# EAGLE design io_board (EAGLE 7.2.0)
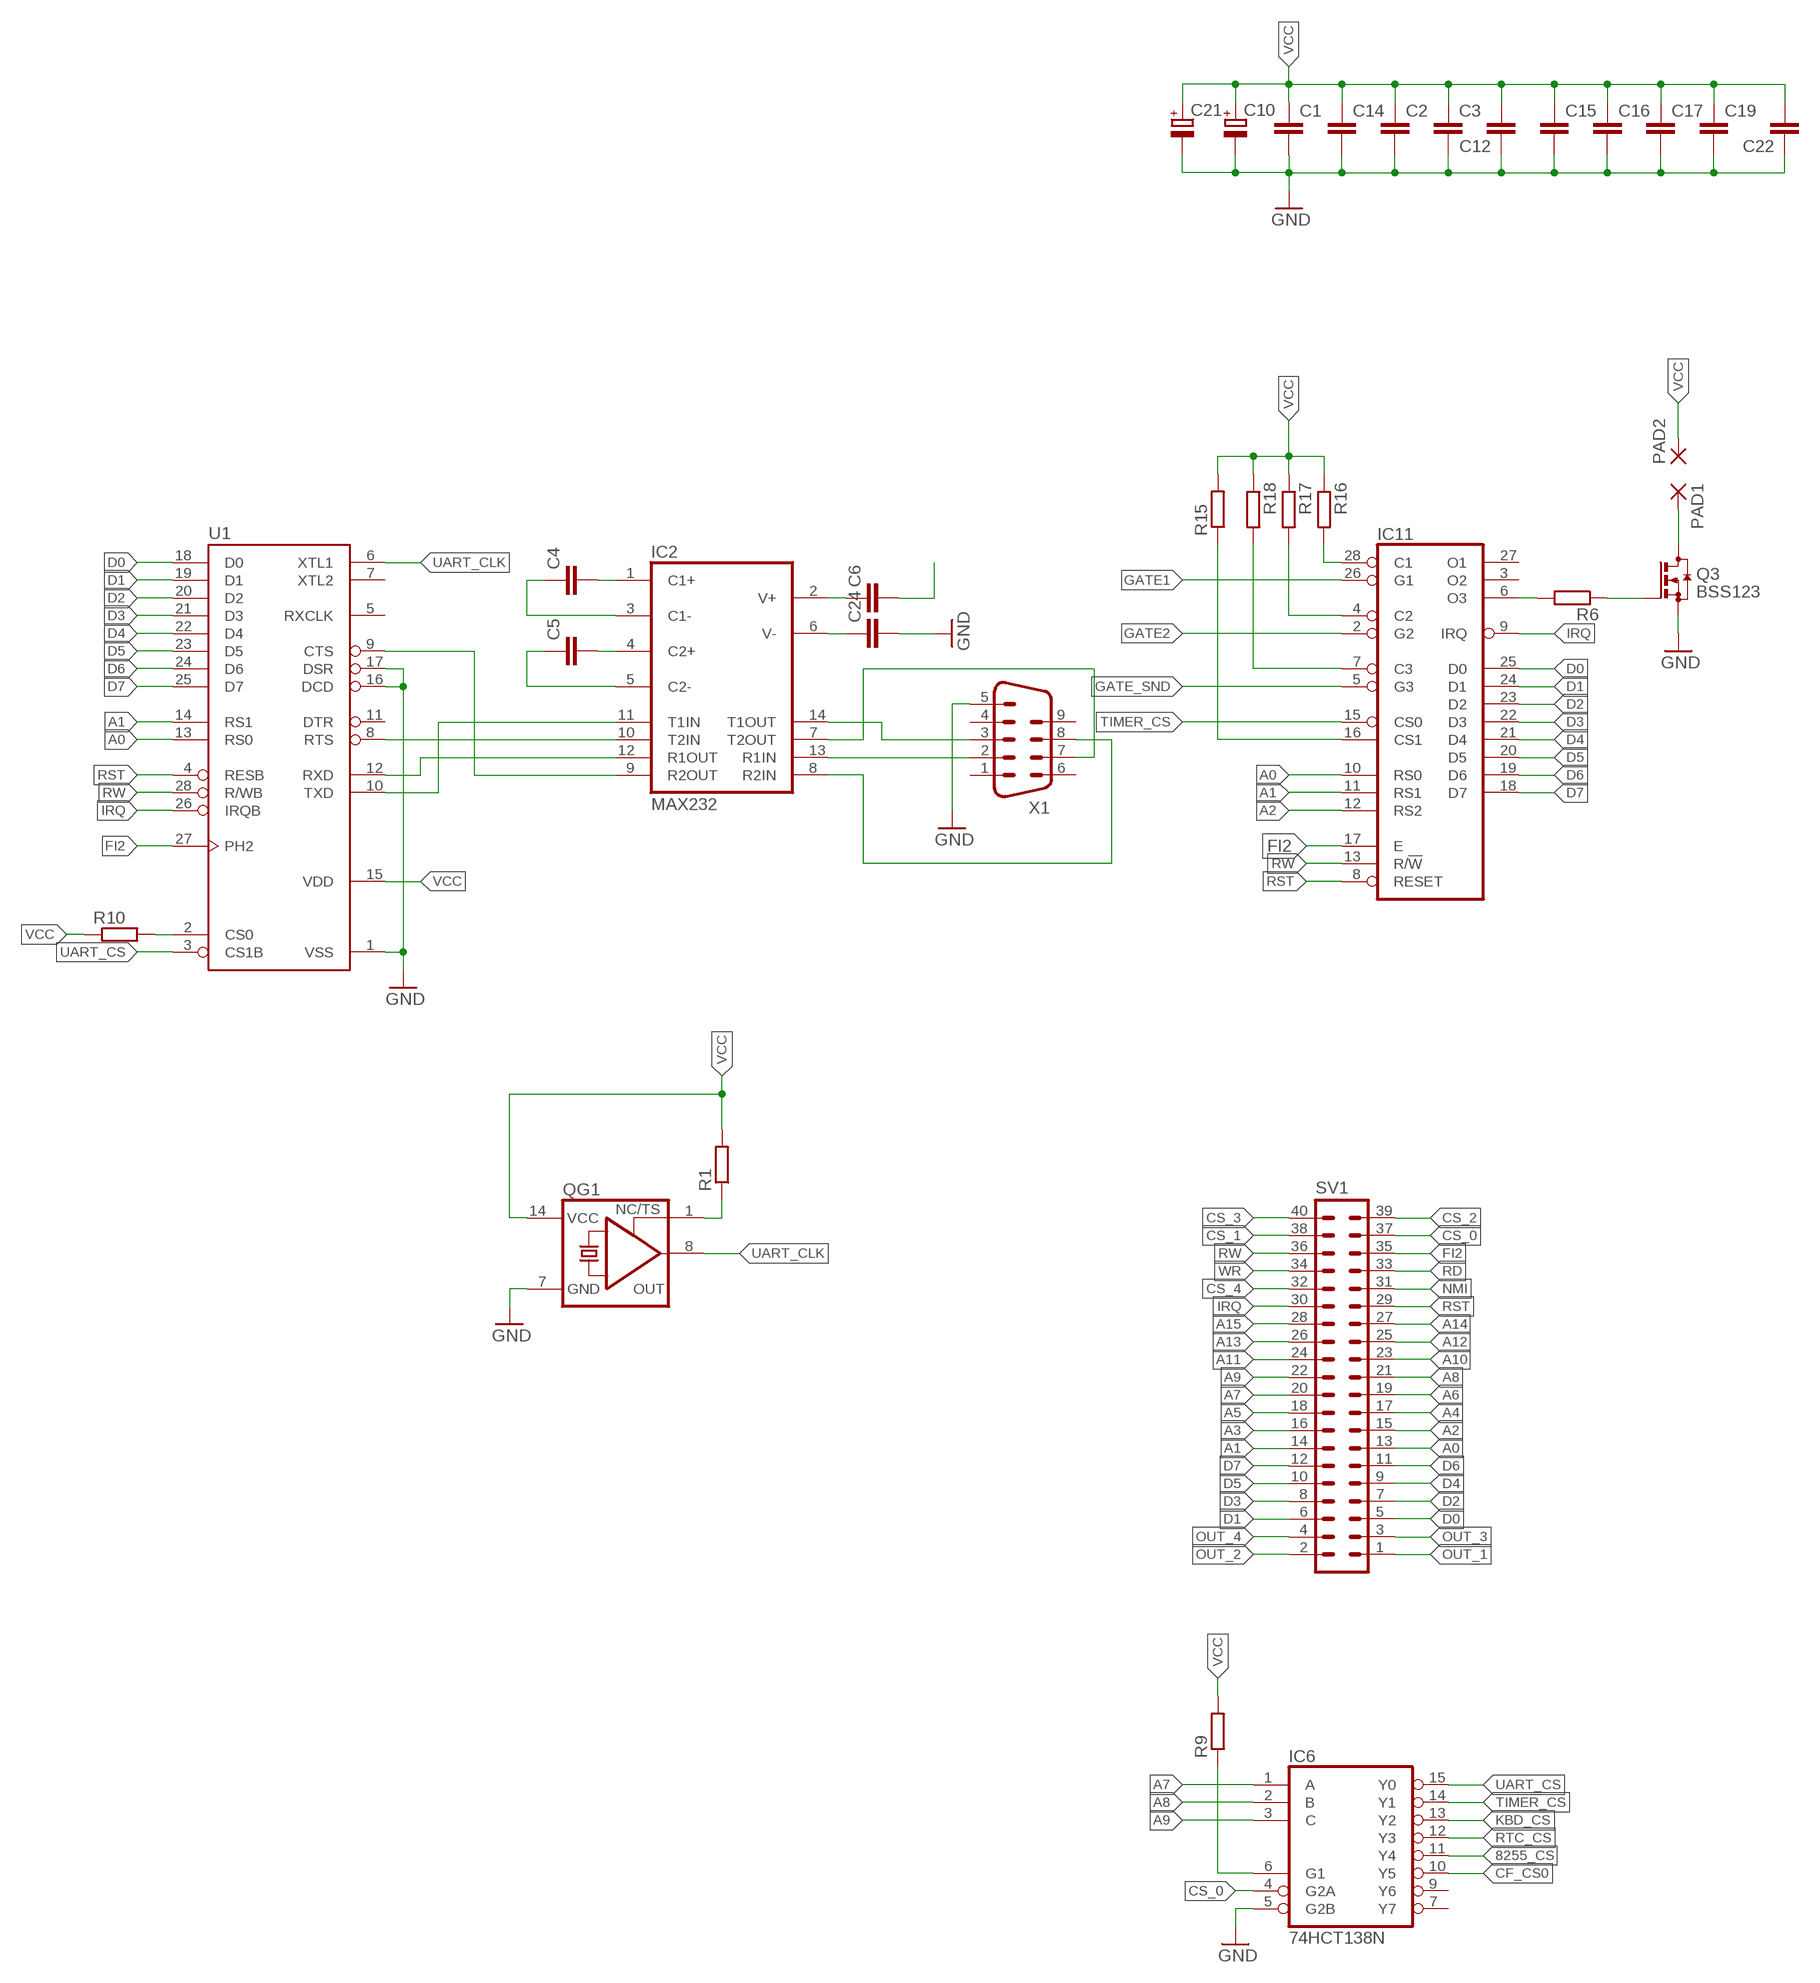
[diagram p0: schematic, sheet 1, part 1 of 2]
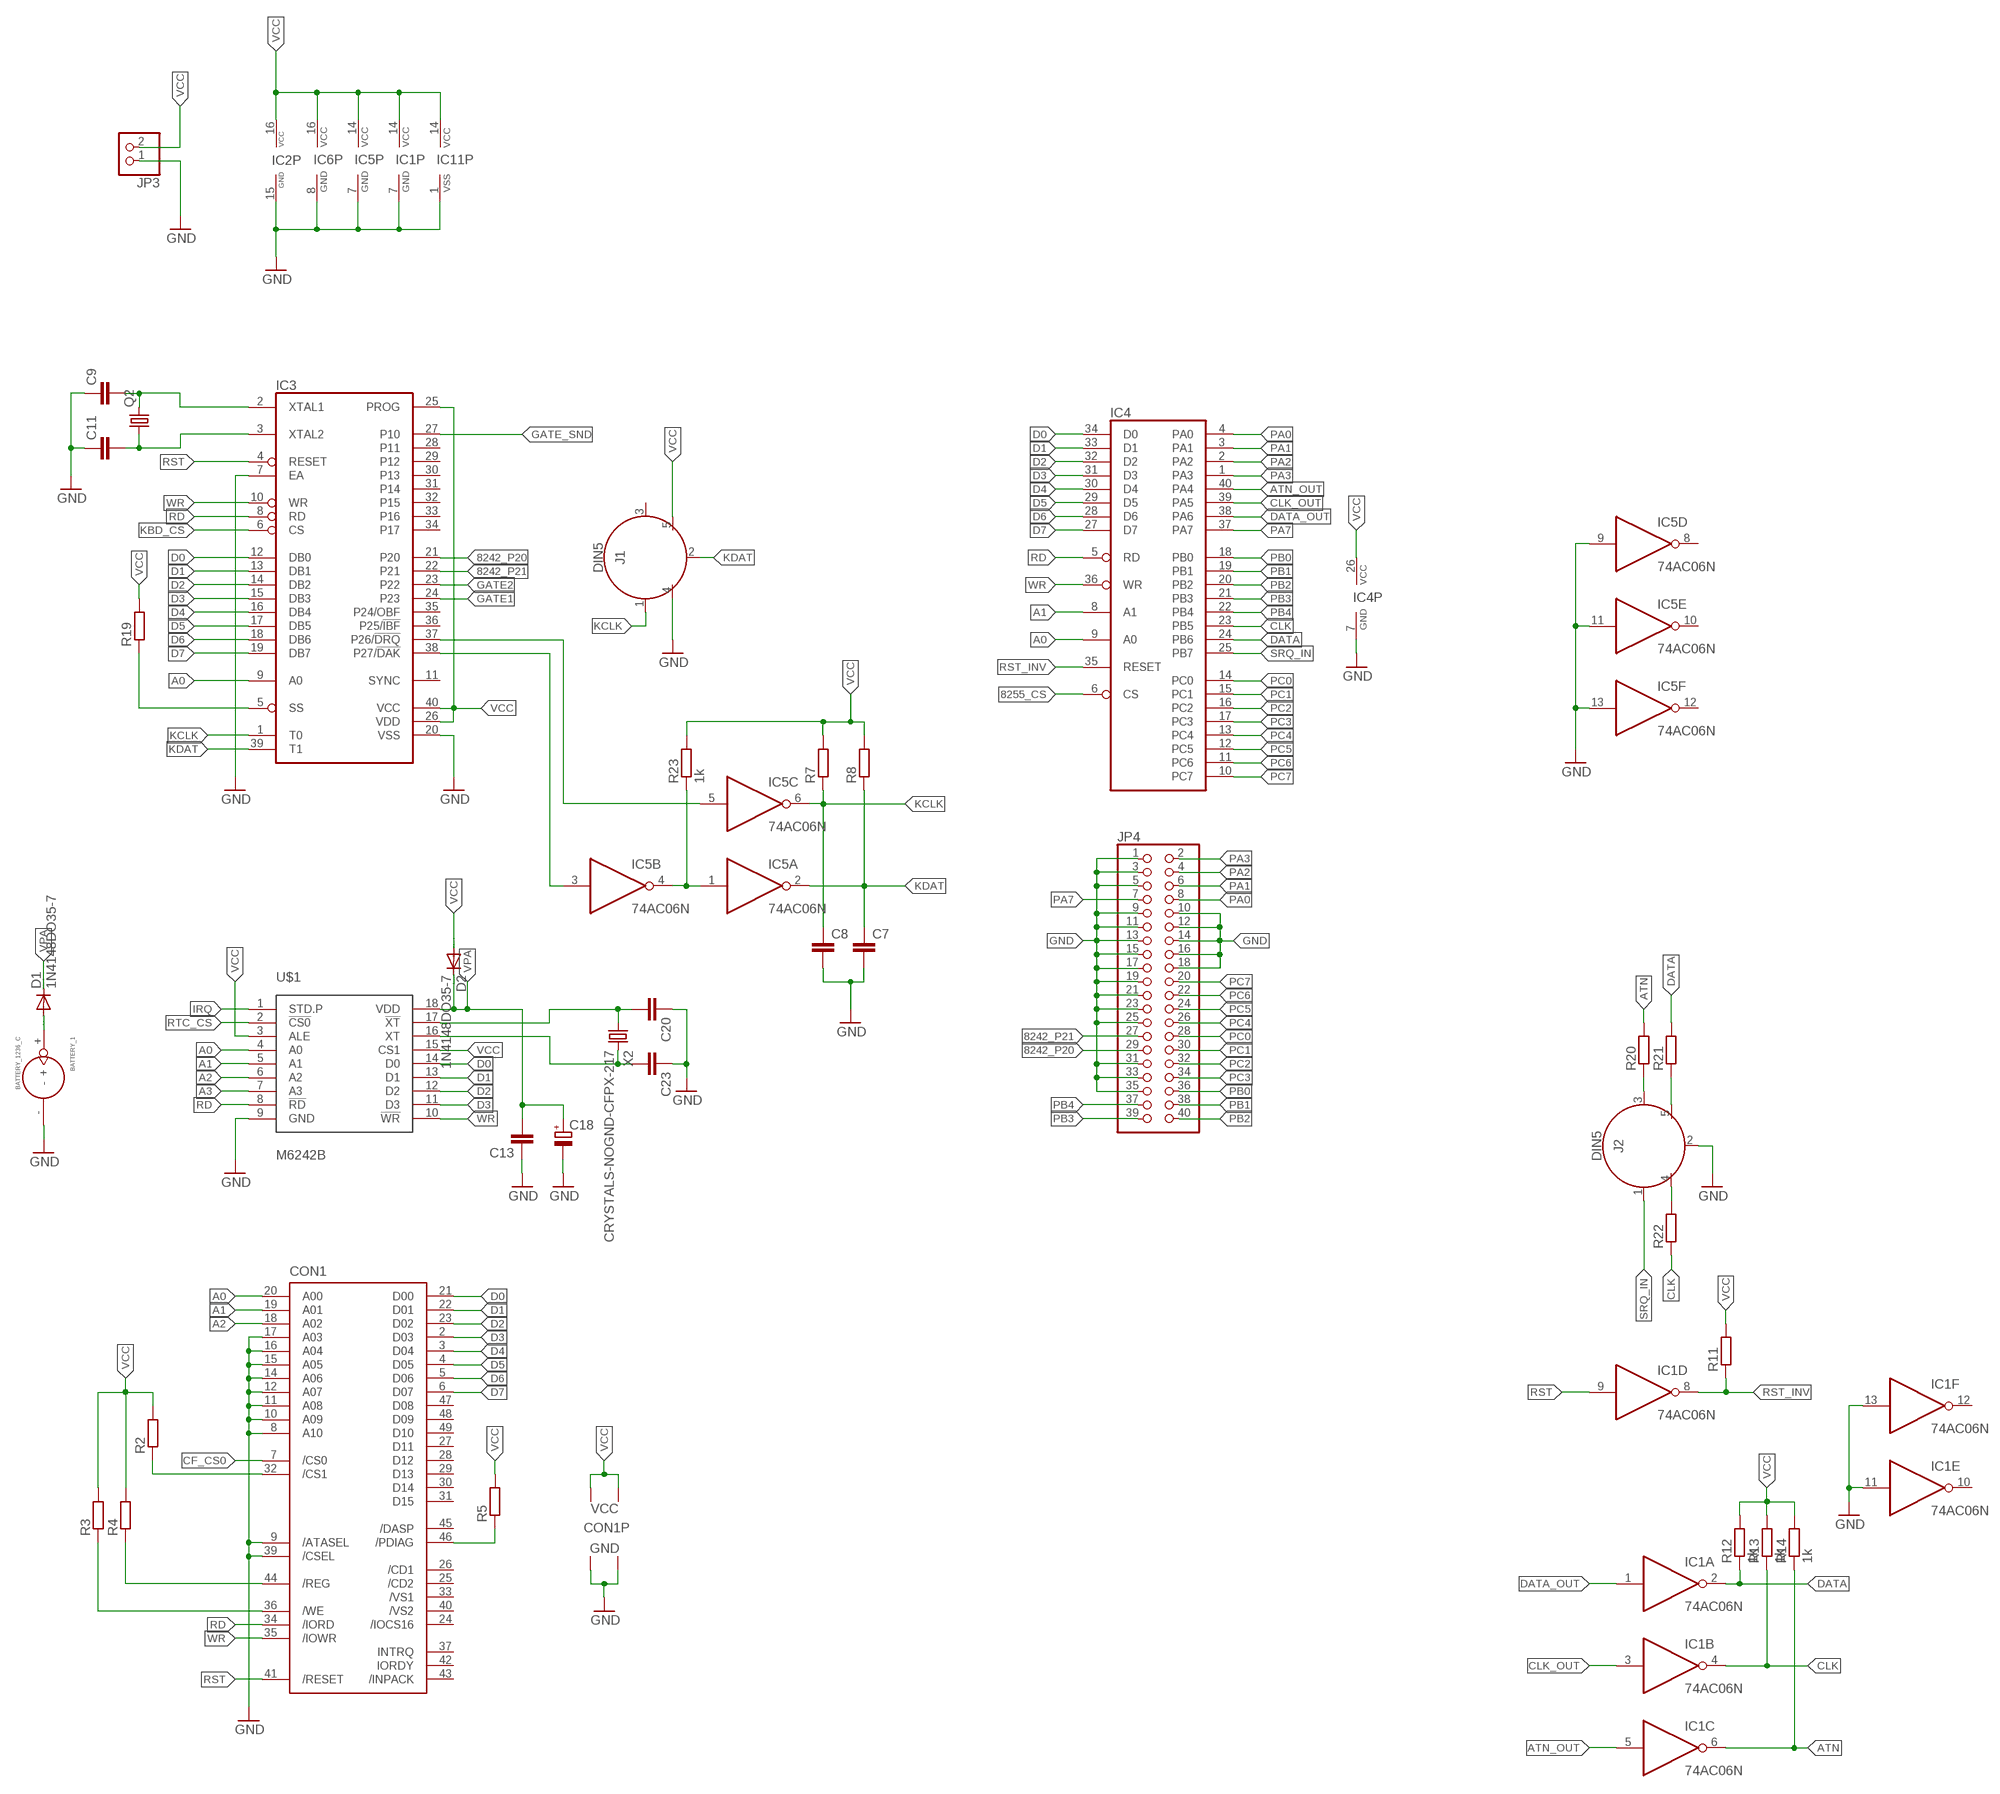
[diagram p1: schematic, sheet 1, part 2 of 2]

## Parts
BATTERY_1  BATTERY_1236_C  [BATTERY_1236_C]
C1  C-EUC1206  [C1206]
C2  C-EUC1206  [C1206]
C3  C-EUC1206  [C1206]
C4  C-EUC0603  [C0603]
C5  C-EUC0603  [C0603]
C6  C-EUC0603  [C0603]
C7  C-EUC0603  [C0603]
C8  C-EUC0603  [C0603]
C9  C-EUC0603  [C0603]
C10  CPOL-EUE5-10.5  [E5-10,5]
C11  C-EUC0603  [C0603]
C12  C-EUC0603  [C0603]
C13  C-EUC0603  [C0603]
C14  C-EUC1206  [C1206]
C15  C-EUC1206  [C1206]
C16  C-EUC1206  [C1206]
C17  C-EUC1206  [C1206]
C18  CPOL-EUSMCB  [SMC_B]
C19  C-EUC0603  [C0603]
C20  C-EUC0603  [C0603]
C21  CPOL-EUSMCB  [SMC_B]
C22  C-EUC0603  [C0603]
C23  C-EUC0603  [C0603]
C24  C-EUC0603  [C0603]
CON1  CF-CARD-IDE_MODE  [MI20-50PD-SF]
D1  1N4148DO35-7  [DO35-7]
D2  1N4148DO35-7  [DO35-7]
IC1  74AC06N  [DIL14]
IC2  MAX232  [DIL16]
IC3  UPI-8042AH  [DIL40]
IC4  8255A  [DIL40]
IC5  74AC06N  [DIL14]
IC6  74HCT138N  [DIL16]
IC11  6840  [DIL28]
J1  DIN5  [DIN5-RA-PTH]
J2  DIN5  [DIN5-RA-PTH]
JP3  PINHD-1X2/90  [1X02/90]
JP4  PINHD-2X20  [2X20]
PAD1  2,15/1,0  [2,15/1,0]
PAD2  2,15/1,0  [2,15/1,0]
Q2  CRYSTALHC49S  [HC49/S]
Q3  BSS123  [SOT23]
QG1  XO-14  [DIL14S]
R1  R-EU_R1206  [R1206]
R2  R-EU_R0603  [R0603]
R3  R-EU_R0603  [R0603]
R4  R-EU_R0603  [R0603]
R5  R-EU_R0603  [R0603]
R6  R-EU_R0603  [R0603]
R7  R-EU_R0603  [R0603]
R8  R-EU_R0603  [R0603]
R9  R-EU_R1206  [R1206]
R10  R-EU_R0603  [R0603]
R11  R-EU_R0603  [R0603]
R12  1k  R-EU_0204/7  [0204/7]
R13  1k  R-EU_0204/5  [0204/5]
R14  1k  R-EU_0204/7  [0204/7]
R15  R-EU_R0603  [R0603]
R16  R-EU_0204/5  [0204/5]
R17  R-EU_R0603  [R0603]
R18  R-EU_R0603  [R0603]
R19  R-EU_0204/5  [0204/5]
R20  R-EU_R0805  [R0805]
R21  R-EU_R0805  [R0805]
R22  R-EU_R0805  [R0805]
R23  1k  R-EU_0204/7  [0204/7]
SV1  ML40L  [ML40L]
U1  G65SC51P  [DIP-28]
U$1  M6242B  [DIL18]
X1  M09HP  [M09HP]
X2  CRYSTALS-NOGND-CFPX-217  [3.2X1.5-2-PAD]

## Nets
8242_P20: IC3.21(P20) JP4.29
8242_P21: IC3.22(P21) JP4.27
8255_CS: IC4.6(CS) IC6.11(Y4)
A0: CON1.20(A00) IC3.9(A0) IC4.9(A0) IC11.10(RS0) SV1.13 U1.13(RS0) U$1.4(A0)
A1: CON1.19(A01) IC4.8(A1) IC11.11(RS1) SV1.14 U1.14(RS1) U$1.5(A1)
A2: CON1.18(A02) IC11.12(RS2) SV1.15 U$1.6(A2)
A3: SV1.16 U$1.7(A3)
A4: SV1.17
A5: SV1.18
A6: SV1.19
A7: IC6.1(A) SV1.20
A8: IC6.2(B) SV1.21
A9: IC6.3(C) SV1.22
A10: SV1.23
A11: SV1.24
A12: SV1.25
A13: SV1.26
A14: SV1.27
A15: SV1.28
ATN: IC1.6(C:O) R14.1 R20.2
ATN_OUT: IC1.5(C:I) IC4.40(PA4)
CF_CS0: CON1.7(/CS0) IC6.10(Y5)
CLK: IC1.4(B:O) IC4.23(PB5) R13.1 R22.1
CLK_OUT: IC1.3(B:I) IC4.39(PA5)
CS_0: IC6.4(G2A) SV1.37
CS_1: SV1.38
CS_2: SV1.39
CS_3: SV1.40
CS_4: SV1.32
CTS_RS232: IC2.8(R2IN) X1.8
CTS_TTL: IC2.9(R2OUT) U1.9(CTS)
D0: CON1.21(D00) IC3.12(DB0) IC4.34(D0) IC11.25(D0) SV1.5 U1.18(D0) U$1.14(D0)
D1: CON1.22(D01) IC3.13(DB1) IC4.33(D1) IC11.24(D1) SV1.6 U1.19(D1) U$1.13(D1)
D2: CON1.23(D02) IC3.14(DB2) IC4.32(D2) IC11.23(D2) SV1.7 U1.20(D2) U$1.12(D2)
D3: CON1.2(D03) IC3.15(DB3) IC4.31(D3) IC11.22(D3) SV1.8 U1.21(D3) U$1.11(D3)
D4: CON1.3(D04) IC3.16(DB4) IC4.30(D4) IC11.21(D4) SV1.9 U1.22(D4)
D5: CON1.4(D05) IC3.17(DB5) IC4.29(D5) IC11.20(D5) SV1.10 U1.23(D5)
D6: CON1.5(D06) IC3.18(DB6) IC4.28(D6) IC11.19(D6) SV1.11 U1.24(D6)
D7: CON1.6(D07) IC3.19(DB7) IC4.27(D7) IC11.18(D7) SV1.12 U1.25(D7)
DATA: IC1.2(A:O) IC4.24(PB6) R12.1 R21.2
DATA_OUT: IC1.1(A:I) IC4.38(PA6)
FI2: IC11.17(E) SV1.35 U1.27(PH2)
GATE1: IC3.24(P23) IC11.26(G1)
GATE2: IC3.23(P22) IC11.2(G2)
GATE_SND: IC3.27(P10) IC11.5(G3)
GND: BATTERY_1.- C1.2 C2.2 C3.2 C7.2 C8.2 C9.1 C10.- C11.1 C12.1 C13.1 C14.2 C15.2 C16.2 C17.2 C18.- C19.2 C20.1 C21.- C22.1 C23.1 C24.2 CON1.1(GND1) CON1.8(A10) CON1.9(/ATASEL) CON1.10(A09) CON1.11(A08) CON1.12(A07) CON1.14(A06) CON1.15(A05) CON1.16(A04) CON1.17(A03) CON1.39(/CSEL) CON1.50(GND2) IC1.7(P:GND) IC1.11(E:I) IC1.13(F:I) IC2.15(GND) IC3.7(EA) IC3.20(VSS) IC4.7(GND) IC5.7(P:GND) IC5.9(D:I) IC5.11(E:I) IC5.13(F:I) IC6.5(G2B) IC6.8(GND) IC11.1(VSS) J1.4 J2.2 JP3.1 JP4.1 JP4.3 JP4.5 JP4.9 JP4.10 JP4.11 JP4.12 JP4.13 JP4.14 JP4.15 JP4.16 JP4.17 JP4.18 JP4.19 JP4.21 JP4.23 JP4.25 JP4.31 JP4.33 JP4.35 Q3.2(S) QG1.7(GND) U1.1(VSS) U1.16(DCD) U1.17(DSR) U$1.9(GND) X1.5
IRQ: IC11.9(IRQ) SV1.30 U1.26(IRQB) U$1.1(STD.P)
KBD_CS: IC3.6(CS) IC6.13(Y2)
KCLK: C8.1 IC3.1(T0) IC5.6(C:O) J1.1 R7.1
KDAT: C7.1 IC3.39(T1) IC5.2(A:O) J1.2 R8.1
N$2: C24.1 IC2.6(V-)
N$3: IC3.38(P27/!DAK) IC5.3(B:I)
N$5: QG1.1(TS) R1.1
N$9: C4.2 IC2.1(C1+)
N$10: C5.2 IC2.4(C2+)
N$11: C5.1 IC2.5(C2-)
N$12: C4.1 IC2.3(C1-)
N$13: C6.1 IC2.2(V+)
N$15: C9.2 IC3.2(XTAL1) Q2.2
N$16: C11.2 IC3.3(XTAL2) Q2.1
N$17: IC3.37(P26/!DRQ) IC5.5(C:I)
N$18: IC6.6(G1) R9.1
N$19: CON1.44(/REG) R4.1
N$20: CON1.36(/WE) R3.1
N$21: CON1.46(/PDIAG) R5.1
N$22: BATTERY_1.+ D1.A
N$26: PAD1.1(P) Q3.3(D)
N$27: R10.2 U1.2(CS0)
N$29: CON1.32(/CS1) R2.1
N$30: IC11.6(O3) R6.2
N$31: IC11.16(CS1) R15.1
N$32: IC11.28(C1) R16.2
N$33: IC11.4(C2) R17.2
N$34: IC11.7(C3) R18.2
N$35: IC3.5(SS) R19.1
N$36: J2.3 R20.1
N$38: J2.5 R21.1
N$39: J2.4 R22.2
N$40: IC5.1(A:I) IC5.4(B:O) R23.1
NMI: SV1.31
OUT_1: SV1.1
OUT_2: SV1.2
OUT_3: SV1.3
OUT_4: SV1.4
PA0: IC4.4(PA0) JP4.8
PA1: IC4.3(PA1) JP4.6
PA2: IC4.2(PA2) JP4.4
PA3: IC4.1(PA3) JP4.2
PA7: IC4.37(PA7) JP4.7
PB0: IC4.18(PB0) JP4.36
PB1: IC4.19(PB1) JP4.38
PB2: IC4.20(PB2) JP4.40
PB3: IC4.21(PB3) JP4.39
PB4: IC4.22(PB4) JP4.37
PC0: IC4.14(PC0) JP4.28
PC1: IC4.15(PC1) JP4.30
PC2: IC4.16(PC2) JP4.32
PC3: IC4.17(PC3) JP4.34
PC4: IC4.13(PC4) JP4.26
PC5: IC4.12(PC5) JP4.24
PC6: IC4.11(PC6) JP4.22
PC7: IC4.10(PC7) JP4.20
RD: CON1.34(/IORD) IC3.8(RD) IC4.5(RD) SV1.33 U$1.8(!RD)
RST: CON1.41(/RESET) IC1.9(D:I) IC3.4(RESET) IC11.8(RESET) SV1.29 U1.4(RESB)
RST_INV: IC1.8(D:O) IC4.35(RESET) R11.1
RTC_CS: IC6.12(Y3) U$1.2(!CS0)
RTS_RS232: IC2.7(T2OUT) X1.7
RTS_TTL: IC2.10(T2IN) U1.8(RTS)
RW: IC11.13(R/!W) SV1.36 U1.28(R/WB)
RXD_RS232: IC2.13(R1IN) X1.2
RXD_TTL: IC2.12(R1OUT) U1.12(RXD)
SND_PULSE: Q3.1(G) R6.1
SOSCI: C20.2 U$1.17(!XT) X2.1
SOSCO: C23.2 U$1.16(XT) X2.2
SRQ_IN: IC4.25(PB7) J2.1
TIMER_CS: IC6.14(Y1) IC11.15(CS0)
TXD_RS232: IC2.14(T1OUT) X1.3
TXD_TTL: IC2.11(T1IN) U1.10(TXD)
UART_CLK: QG1.8(OUT) U1.6(XTL1)
UART_CS: IC6.15(Y0) U1.3(CS1B)
VCC: C1.1 C2.1 C3.1 C6.2 C10.+ C12.2 C14.1 C15.1 C16.1 C17.1 C19.1 C21.+ C22.2 CON1.13(VCC2) CON1.38(VCC1) D2.A IC1.14(P:VCC) IC2.16(VCC) IC3.25(PROG) IC3.26(VDD) IC3.40(VCC) IC4.26(VCC) IC5.14(P:VCC) IC6.16(VCC) IC11.14(VCC) J1.5 JP3.2 PAD2.1(P) QG1.14(VCC) R1.2 R2.2 R3.2 R4.2 R5.2 R7.2 R8.2 R9.2 R10.1 R11.2 R12.2 R13.2 R14.2 R15.2 R16.1 R17.1 R18.1 R19.2 R23.2 U1.15(VDD) U$1.3(ALE) U$1.15(CS1)
VPA: C13.2 C18.+ D1.C D2.C U$1.18(VDD)
WR: CON1.35(/IOWR) IC3.10(WR) IC4.36(WR) SV1.34 U$1.10(!WR)
Unconnected: CON1.24(/IOCS16) CON1.25(/CD2) CON1.26(/CD1) CON1.27(D11) CON1.28(D12) CON1.29(D13) CON1.30(D14) CON1.31(D15) CON1.33(/VS1) CON1.37(INTRQ) CON1.40(/VS2) CON1.42(IORDY) CON1.43(/INPACK) CON1.45(/DASP) CON1.47(D08) CON1.48(D09) CON1.49(D10) IC1.10(E:O) IC1.12(F:O) IC3.11(SYNC) IC3.28(P11) IC3.29(P12) IC3.30(P13) IC3.31(P14) IC3.32(P15) IC3.33(P16) IC3.34(P17) IC3.35(P24/OBF) IC3.36(P25/!IBF) IC5.8(D:O) IC5.10(E:O) IC5.12(F:O) IC6.7(Y7) IC6.9(Y6) IC11.3(O2) IC11.27(O1) J1.3 U1.5(RXCLK) U1.7(XTL2) U1.11(DTR) X1.1 X1.4 X1.6 X1.9

## Library data of the parts
BATTERY_1 = Itead_BP_110825.lbr:BATTERY_1236_C: SOC004
C1-C9 C11-C17 C19 C20 C22-C24 = rcl:C-EU: CAPACITOR, European symbol
C10 C18 C21 = rcl:CPOL-EU: POLARIZED CAPACITOR, European symbol
CON1 = con-hirose:CF-CARD-IDE_MODE: Compact Flash Adapter Type I or II without Eject Button Source: con-hirose.lbr from Bob Starr <rtzaudio@mindspring.com>; OC_FARNELL: unknown; OC_NEWARK: unknown
D1 D2 = diode:1N4148: DIODE high speed (Philips)
IC1 IC5 = 74xx-eu:74*06: Hex INVERTER, open collector high-voltage output
IC2 = maxim:MAX232: RS232 TRANSCEIVER; MF: MAXIM; MPN: MAX232ACPE+; OC_FARNELL: 9723773; OC_NEWARK: 68K4544
IC3 = micro-intel:UPI-8042AH: MICROCOMPUTER/PERIPHERAL DEVICE; OC_FARNELL: unknown; OC_NEWARK: unknown
IC4 = micro-intel:8255A: MICROCOMPUTER/PERIPHERAL DEVICE; OC_FARNELL: unknown; OC_NEWARK: unknown
IC6 = 74xx-eu:74*138: 3-line to 8-line DECODER/DEMULTIPLEXER
IC11 = micro-motorola:6840: MICROCONTROLLER/MEMORY DEVICE; OC_FARNELL: unknown; OC_NEWARK: unknown
J1 J2 = SparkFun-Connectors:DIN5: DIN5 Connector - Female Right Angle (frequently used as a MIDI Jack connector) This type of connector and cable is frequently used for transmitting midi data (musical instrument digital interface). It is what you usually see on a keyboard or set of electronic drums. Learn more here <https://en.wikipedia.org/wiki/MIDI>. For more information on the pinout and electrical specifications of MIDI communications, please see the following resource: https://www.midi.org/specifications/item/midi-din-electrical-specification Here is the connector we sell at SparkFun: MIDI Connector - Female Right Angle <https://www.sparkfun.com/products/9536> (PRT-09536) Datasheet <hhttp://www.sparkfun.com/datasheets/Prototyping/Connectors/MIDI-RA.pdf> It is used on this SparkFun product: SparkFun MIDI Shield <https://www.sparkfun.com/products/12898> (DEV-12898); PROD_ID: CONN-09481
JP3 = pinhead:PINHD-1X2: PIN HEADER
JP4 = pinhead:PINHD-2X20: PIN HEADER
PAD1 PAD2 = wirepad:2,15/1,0: THROUGH-HOLE PAD
Q2 = crystal:CRYSTAL: CRYSTAL; OC_FARNELL: 1667008; OC_NEWARK: unknown
Q3 = transistor-small-signal:BSS123: N-CHANNEL MOS FET
QG1 = crystal:XO-: CRYSTAL; OC_FARNELL: unknown; OC_NEWARK: unknown
R1-R23 = rcl:R-EU_: RESISTOR, European symbol
SV1 = con-harting-ml:ML40: HARTING; OC_FARNELL: unknown; OC_NEWARK: unknown
U1 = 65xxx:G65SC51P: California Micro Devices Version
U$1 = mw:M6242B
X1 = con-subd:M09: SUB-D; OC_FARNELL: unknown; OC_NEWARK: unknown
X2 = IQD-Frequency-Products:CRYSTALS-NOGND: CRYSTALS CAN NOT GROUNDED

## Board
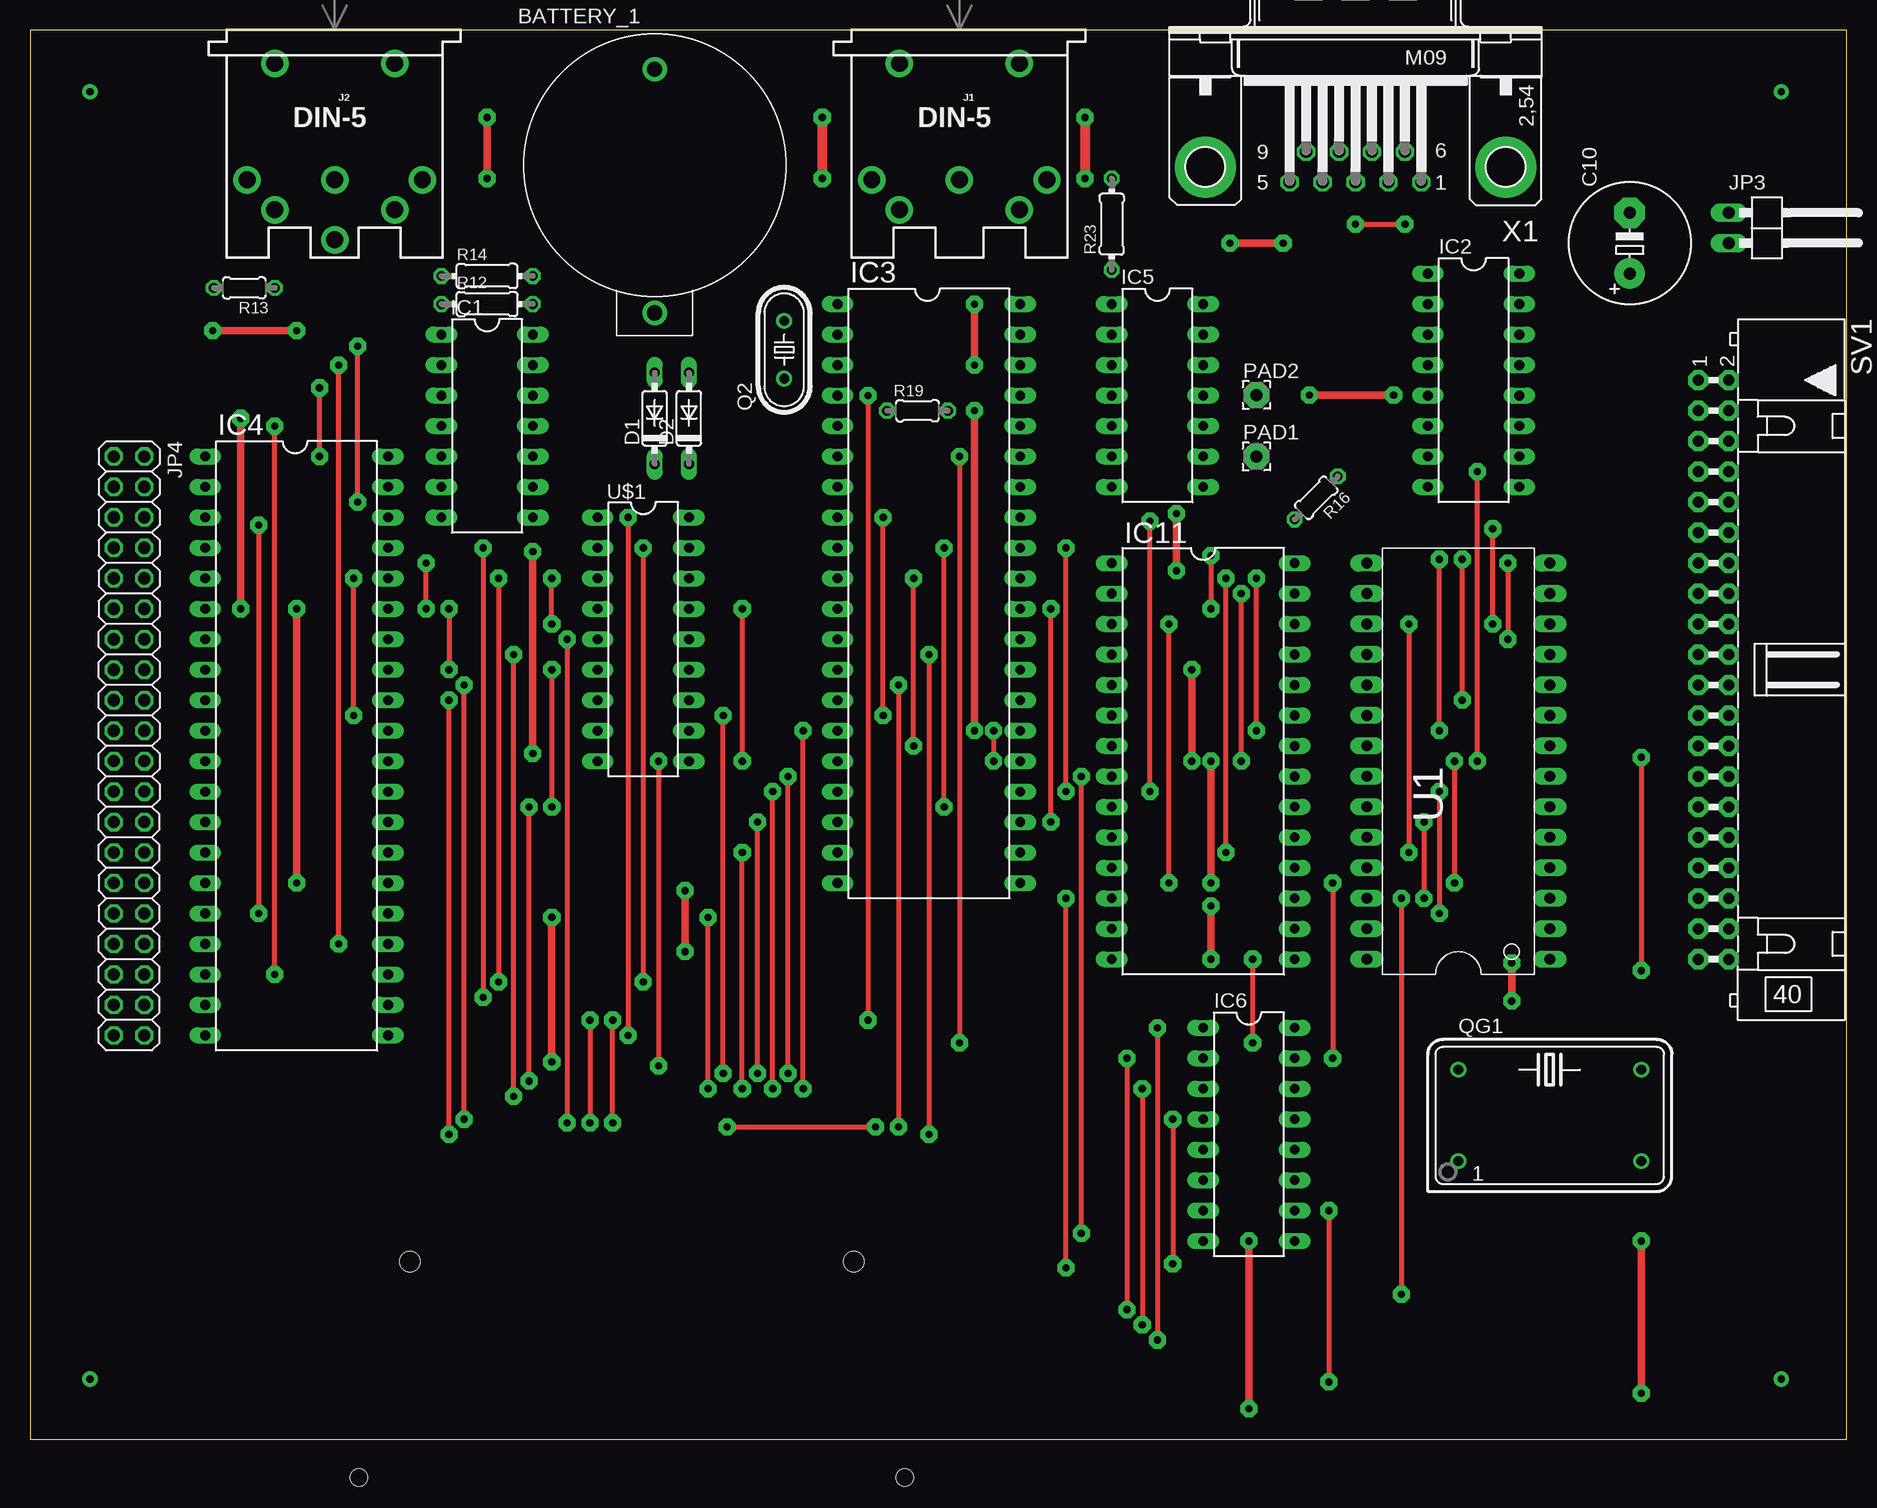
[diagram p2: board, top side]
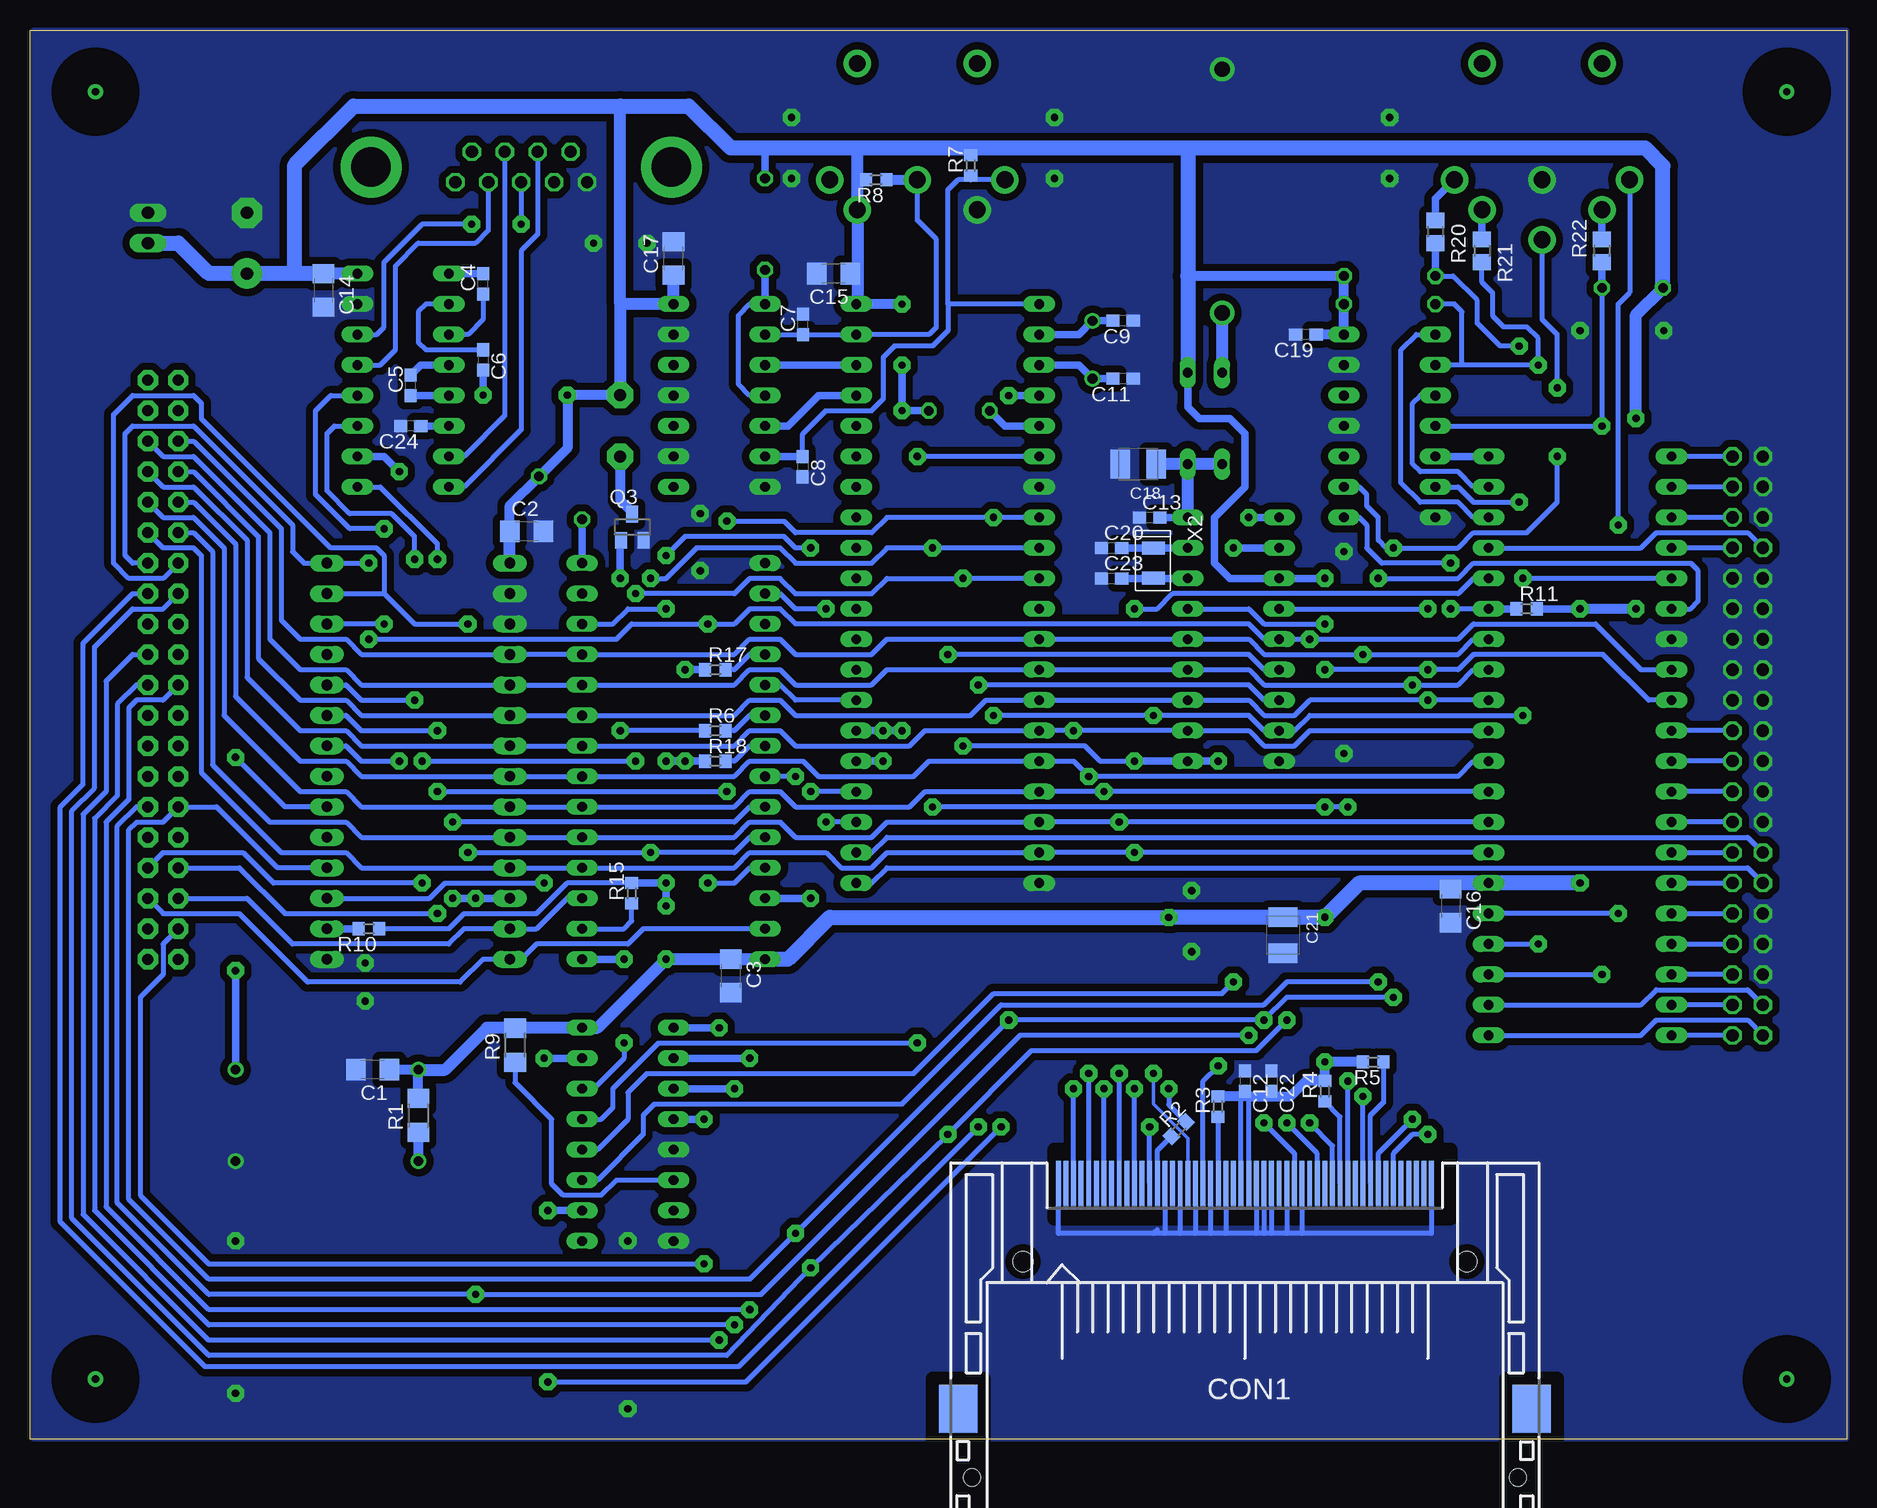
[diagram p3: board, bottom side, seen from below]

Size 151.44 x 117.47 mm. Coordinates in mm from the lower left corner, seen from the top.
Outline: 0,0 151.44,0 151.44,117.47 0,117.47 0,0
Copper layers (1*16): Top 0.035mm / dielectric 1.5mm / Bottom 0.035mm
Design rules "default *": minimum track width 10mil, minimum drill 24mil, track to track 8mil, track to pad 8mil, pad to pad 8mil, via to via 8mil, smd to smd 8mil, copper to edge 0mil, drill to drill 8mil, minimum pad ring 10mil, minimum via ring 8mil, stop-mask expansion 4mil, vias tented up to drill 0mil, thermal gap 10mil
bRestrict: area 2,2 to 8,8; area 2,109.3 to 8,115.4; area 142.9,2 to 149,8; area 142.9,109.3 to 149,115.4; area 33,18.4 to 66,24.1

### Footprints (pad centres in the part's own frame; a part is rotated, then mirrored left to right if it is on the bottom)
BATTERY_1236_C = drill 1.27 pad 2.032: + 0,0; - 0,20.32
C1206 = smd 1.6 x 1.8: 1 -1.4,0; 2 1.4,0
C0603 = smd 1.1 x 1: 1 -0.85,0; 2 0.85,0
E5-10,5 = drill 1.016 pad 2.54: + -2.54,0 | drill 1.016 pad 2.54 octagon: - 2.54,0
SMC_B = smd 1.6 x 2.4: + -1.5,0; - 1.5,0
MI20-50PD-SF = smd 0.41 x 3.75: 1 15.557,-18.78; 2 14.287,-18.78; 3 13.018,-18.78; 4 11.748,-18.78; 5 10.477,-18.78; 6 9.207,-18.78; 7 7.938,-18.78; 8 6.668,-18.78; 9 5.397,-18.78; 10 4.128,-18.78; 11 2.857,-18.78; 12 1.587,-18.78; 13 0.318,-18.78; 14 -0.953,-18.78; 15 -2.223,-18.78; 16 -3.493,-18.78; 17 -4.763,-18.78; 18 -6.032,-18.78; 19 -7.303,-18.78; 20 -8.572,-18.78; 21 -9.842,-18.78; 22 -11.113,-18.78; 23 -12.383,-18.78; 24 -13.652,-18.78; 25 -14.922,-18.78; 26 14.922,-18.78; 27 13.652,-18.78; 28 12.383,-18.78; 29 11.113,-18.78; 30 9.842,-18.78; 31 8.572,-18.78; 32 7.303,-18.78; 33 6.032,-18.78; 34 4.763,-18.78; 35 3.493,-18.78; 36 2.223,-18.78; 37 0.953,-18.78; 38 -0.318,-18.78; 39 -1.587,-18.78; 40 -2.857,-18.78; 41 -4.128,-18.78; 42 -5.397,-18.78; 43 -6.668,-18.78; 44 -7.938,-18.78; 45 -9.207,-18.78; 46 -10.477,-18.78; 47 -11.748,-18.78; 48 -13.018,-18.78; 49 -14.287,-18.78; 50 -15.557,-18.78 | smd 3.2 x 4: M1 -23.883,-0.005; M2 23.883,-0.005 | hole 1.676: 18.5,-12.25; -18.5,-12.25 | hole 1.422: -22.75,5.75; 22.75,5.75
DO35-7 = drill 0.813 long: A 3.81,0; C -3.81,0
DIL14 = drill 0.813 long: 1 -7.62,-3.81; 2 -5.08,-3.81; 3 -2.54,-3.81; 4 0,-3.81; 5 2.54,-3.81; 6 5.08,-3.81; 7 7.62,-3.81; 8 7.62,3.81; 9 5.08,3.81; 10 2.54,3.81; 11 0,3.81; 12 -2.54,3.81; 13 -5.08,3.81; 14 -7.62,3.81
DIL16 = drill 0.813 long: 1 -8.89,-3.81; 2 -6.35,-3.81; 3 -3.81,-3.81; 4 -1.27,-3.81; 5 1.27,-3.81; 6 3.81,-3.81; 7 6.35,-3.81; 8 8.89,-3.81; 9 8.89,3.81; 10 6.35,3.81; 11 3.81,3.81; 12 1.27,3.81; 13 -1.27,3.81; 14 -3.81,3.81; 15 -6.35,3.81; 16 -8.89,3.81
DIL40 = drill 0.813 long: 1 -24.13,-7.62; 2 -21.59,-7.62; 3 -19.05,-7.62; 4 -16.51,-7.62; 5 -13.97,-7.62; 6 -11.43,-7.62; 7 -8.89,-7.62; 8 -6.35,-7.62; 9 -3.81,-7.62; 10 -1.27,-7.62; 11 1.27,-7.62; 12 3.81,-7.62; 13 6.35,-7.62; 14 8.89,-7.62; 15 11.43,-7.62; 16 13.97,-7.62; 17 16.51,-7.62; 18 19.05,-7.62; 19 21.59,-7.62; 20 24.13,-7.62; 21 24.13,7.62; 22 21.59,7.62; 23 19.05,7.62; 24 16.51,7.62; 25 13.97,7.62; 26 11.43,7.62; 27 8.89,7.62; 28 6.35,7.62; 29 3.81,7.62; 30 1.27,7.62; 31 -1.27,7.62; 32 -3.81,7.62; 33 -6.35,7.62; 34 -8.89,7.62; 35 -11.43,7.62; 36 -13.97,7.62; 37 -16.51,7.62; 38 -19.05,7.62; 39 -21.59,7.62; 40 -24.13,7.62
DIL28 = drill 0.813 long: 1 -16.51,-7.62; 2 -13.97,-7.62; 3 -11.43,-7.62; 4 -8.89,-7.62; 5 -6.35,-7.62; 6 -3.81,-7.62; 7 -1.27,-7.62; 8 1.27,-7.62; 9 3.81,-7.62; 10 6.35,-7.62; 11 8.89,-7.62; 12 11.43,-7.62; 13 13.97,-7.62; 14 16.51,-7.62; 15 16.51,7.62; 16 13.97,7.62; 17 11.43,7.62; 18 8.89,7.62; 19 6.35,7.62; 20 3.81,7.62; 21 1.27,7.62; 22 -1.27,7.62; 23 -3.81,7.62; 24 -6.35,7.62; 25 -8.89,7.62; 26 -11.43,7.62; 27 -13.97,7.62; 28 -16.51,7.62
DIN5-RA-PTH = drill 1.4 pad 2.286: 1 7.3,12.5; 2 0,12.5; 3 -7.3,12.5; 4 5,15; 5 -5,15; 6 -5,2.8; 7 5,2.8
1X02/90 = drill 1.016 long: 1 -1.27,-3.81; 2 1.27,-3.81
2X20 = drill 1.016 octagon: 1 -24.13,-1.27; 2 -24.13,1.27; 3 -21.59,-1.27; 4 -21.59,1.27; 5 -19.05,-1.27; 6 -19.05,1.27; 7 -16.51,-1.27; 8 -16.51,1.27; 9 -13.97,-1.27; 10 -13.97,1.27; 11 -11.43,-1.27; 12 -11.43,1.27; 13 -8.89,-1.27; 14 -8.89,1.27; 15 -6.35,-1.27; 16 -6.35,1.27; 17 -3.81,-1.27; 18 -3.81,1.27; 19 -1.27,-1.27; 20 -1.27,1.27; 21 1.27,-1.27; 22 1.27,1.27; 23 3.81,-1.27; 24 3.81,1.27; 25 6.35,-1.27; 26 6.35,1.27; 27 8.89,-1.27; 28 8.89,1.27; 29 11.43,-1.27; 30 11.43,1.27; 31 13.97,-1.27; 32 13.97,1.27; 33 16.51,-1.27; 34 16.51,1.27; 35 19.05,-1.27; 36 19.05,1.27; 37 21.59,-1.27; 38 21.59,1.27; 39 24.13,-1.27; 40 24.13,1.27
2,15/1,0 = drill 1.016 pad 2.159 octagon: 1 0,0
HC49/S = drill 0.813: 1 -2.413,0; 2 2.413,0
SOT23 = smd 1 x 1.4: 1 -0.95,-1.1; 2 0.95,-1.1; 3 0,1.1
DIL14S = drill 0.813: 1 -7.62,-3.81; 7 7.62,-3.81; 8 7.62,3.81; 14 -7.62,3.81
R1206 = smd 1.6 x 1.803: 1 -1.422,0; 2 1.422,0
R0603 = smd 1 x 1.1: 1 -0.85,0; 2 0.85,0
0204/7 = drill 0.813 octagon: 1 -3.81,0; 2 3.81,0
0204/5 = drill 0.813 octagon: 1 -2.54,0; 2 2.54,0
R0805 = smd 1.3 x 1.5: 1 -0.95,0; 2 0.95,0
ML40L = drill 0.914 pad 1.676 octagon: 1 -24.13,-1.27; 2 -24.13,1.27; 3 -21.59,-1.27; 4 -21.59,1.27; 5 -19.05,-1.27; 6 -19.05,1.27; 7 -16.51,-1.27; 8 -16.51,1.27; 9 -13.97,-1.27; 10 -13.97,1.27; 11 -11.43,-1.27; 12 -11.43,1.27; 13 -8.89,-1.27; 14 -8.89,1.27; 15 -6.35,-1.27; 16 -6.35,1.27; 17 -3.81,-1.27; 18 -3.81,1.27; 19 -1.27,-1.27; 20 -1.27,1.27; 21 1.27,-1.27; 22 1.27,1.27; 23 3.81,-1.27; 24 3.81,1.27; 25 6.35,-1.27; 26 6.35,1.27; 27 8.89,-1.27; 28 8.89,1.27; 29 11.43,-1.27; 30 11.43,1.27; 31 13.97,-1.27; 32 13.97,1.27; 33 16.51,-1.27; 34 16.51,1.27; 35 19.05,-1.27; 36 19.05,1.27; 37 21.59,-1.27; 38 21.59,1.27; 39 24.13,-1.27; 40 24.13,1.27
DIP-28 = drill 0.889 long: 1 -15.24,-7.62; 2 -12.7,-7.62; 3 -10.16,-7.62; 4 -7.62,-7.62; 5 -5.08,-7.62; 6 -2.54,-7.62; 7 0,-7.62; 8 2.54,-7.62; 9 5.08,-7.62; 10 7.62,-7.62; 11 10.16,-7.62; 12 12.7,-7.62; 13 15.24,-7.62; 14 17.78,-7.62; 15 17.78,7.62; 16 15.24,7.62; 17 12.7,7.62; 18 10.16,7.62; 19 7.62,7.62; 20 5.08,7.62; 21 2.54,7.62; 22 0,7.62; 23 -2.54,7.62; 24 -5.08,7.62; 25 -7.62,7.62; 26 -10.16,7.62; 27 -12.7,7.62; 28 -15.24,7.62
DIL18 = drill 0.813 long: 1 -10.16,-3.81; 2 -7.62,-3.81; 3 -5.08,-3.81; 4 -2.54,-3.81; 5 0,-3.81; 6 2.54,-3.81; 7 5.08,-3.81; 8 7.62,-3.81; 9 10.16,-3.81; 10 10.16,3.81; 11 7.62,3.81; 12 5.08,3.81; 13 2.54,3.81; 14 0,3.81; 15 -2.54,3.81; 16 -5.08,3.81; 17 -7.62,3.81; 18 -10.16,3.81
M09HP = drill 1.016 octagon: 1 -5.486,1.27; 2 -2.743,1.27; 3 0,1.27; 4 2.743,1.27; 5 5.486,1.27; 6 -4.115,-1.27; 7 -1.372,-1.27; 8 1.372,-1.27; 9 4.115,-1.27 | drill 3.302 pad 5.08: G1 -12.522,0; G2 12.522,0
3.2X1.5-2-PAD = smd 1.1 x 1.9: 1 -1.25,0; 2 1.25,0

### Placement (x,y rotation side)
BATTERY_1  52.07,93.88 0 top
C1  122.87,30.8 180 bottom
C2  110.04,75.68 0 bottom
C3  93.03,38.61 270 bottom
C4  113.67,96.3 90 bottom
C5  119.7,87.85 90 bottom
C6  113.67,89.95 270 bottom
C7  87,92.93 90 bottom
C8  87.02,81.06 270 bottom
C9  60.33,93.22 180 bottom
C10  133.35,99.69 90 top
C11  60.33,88.39 180 bottom
C12  50.16,29.84 270 bottom
C13  58.1,76.83 0 bottom
C14  126.97,95.76 270 bottom
C15  84.45,97.16 180 bottom
C16  33.02,44.45 270 bottom
C17  97.79,98.42 90 bottom
C18  59.05,81.28 180 bottom
C19  45.09,92.08 180 bottom
C20  61.28,74.3 0 bottom
C21  46.99,42 270 bottom
C22  47.94,29.84 270 bottom
C23  61.28,71.75 0 bottom
C24  119.7,84.45 180 bottom
CON1  50.16,2.54 180 bottom
D1  52.07,85.09 90 top
D2  54.93,85.09 90 top
IC1  38.1,84.45 270 top
IC2  120.33,88.27 270 top
IC3  74.93,70.48 270 top
IC4  22.23,57.78 270 top
IC5  93.98,87 270 top
IC6  101.6,25.4 270 top
IC11  97.79,56.52 270 top
J1  77.47,117.47 180 top
J2  25.4,117.47 180 top
JP3  145.41,100.97 270 top
JP4  8.26,57.78 270 top
PAD1  102.23,81.92 0 top
PAD2  102.23,87.03 0 top
Q2  62.87,90.81 90 top
Q3  101.23,76.02 0 bottom
QG1  126.68,26.99 0 top
R1  119.06,26.99 90 bottom
R2  55.69,25.84 45 bottom
R3  52.41,27.72 90 bottom
R4  43.5,28.99 90 bottom
R5  39.47,31.43 180 bottom
R6  94.3,59.05 0 bottom
R7  73.03,106.16 90 bottom
R8  80.9,104.98 180 bottom
R9  111,32.83 90 bottom
R10  123.19,42.55 180 bottom
R11  26.67,69.22 0 bottom
R12  38.1,94.61 0 top
R13  17.86,95.97 180 top
R14  38.1,96.95 0 top
R15  101.28,45.5 90 bottom
R16  107.21,78.46 225 top
R17  94.3,64.14 0 bottom
R18  94.3,56.52 0 bottom
R19  73.98,85.72 0 top
R20  34.29,100.65 270 bottom
R21  30.4,99.06 270 bottom
R22  20.4,99.06 90 bottom
R23  90.17,101.28 90 top
SV1  140.34,64.14 270 top
U1  119.06,55.24 90 top
U$1  51.12,66.67 270 top
X1  110.49,106.05 180 top
X2  57.78,73.03 270 bottom

### Tracks (layer width: path | path; a pad name or v marks a point on that pad's centre or on a via)
8242_P20
  Bottom 0.406: IC3.21 81.28,46.35 80.01,47.62 8.26,47.62 JP4.29
8242_P21
  Bottom 0.406: IC3.22 81.28,48.9 80.01,50.16 8.26,50.16 JP4.27
8255_CS  (via drill 0.6 pad 1.42)
  Top 0.406: v39.05,71.75 v39.05,38.1
  Bottom 0.406: IC4.6 13.02,69.22 12.38,69.85 12.38,72.39 13.02,73.03 31.11,73.03 32.38,71.75 v39.05,71.75 | IC6.11 104.14,21.59 100.33,25.4 100.33,26.99 99.38,27.94 78.74,27.94 70.48,36.2 48.58,36.2 46.67,38.1 v39.05,38.1
A0  (via drill 0.6 pad 1.42)
  Top 0.406: v76.2,52.7 v76.2,74.3 | v99.69,48.9 v99.69,71.75 | v41.59,29.84 v41.59,52.7 | v114.94,67.94 v114.94,48.9 | v34.92,69.22 v34.92,64.14 | v43.5,64.14 v43.5,52.7
  Bottom 0.406: U1.13 121.92,70.48 | SV1.13 140.34,71.75 143.19,71.75 144.46,73.03 144.46,85.41 142.88,87 137.79,87 137.16,86.36 137.16,85.09 126.36,74.3 122.56,74.3 121.92,73.66 121.92,70.48 | IC4.9 16.51,61.59 20.32,65.41 31.11,65.41 32.38,64.14 v34.92,64.14 v43.5,64.14 | IC3.9 v76.2,74.3 80.01,74.3 81.28,73.03 87.63,73.03 88.9,74.3 95.89,74.3 98.42,71.75 v99.69,71.75 | IC11.10 91.44,50.16 92.71,48.9 v99.69,48.9 v114.94,48.9 | CON1.20 v41.59,29.84 | v41.59,52.7 v43.5,52.7 v76.2,52.7 | 121.92,70.48 119.38,67.94 v114.94,67.94 | U$1.4 v34.92,69.22
A1  (via drill 0.6 pad 1.42)
  Top 0.406: v123.19,73.03 v123.19,66.67 | v94.93,46.35 v94.93,67.94 | v44.77,66.67 v44.77,26.35
  Bottom 0.406: SV1.14 142.88,73.03 143.51,73.66 143.51,83.82 142.88,84.45 137.79,84.45 129.54,76.2 129.54,73.98 128.59,73.03 U1.14 v123.19,73.03 | IC4.8 17.14,64.14 20.95,67.94 31.11,67.94 32.38,66.67 U$1.5 | U$1.5 48.58,66.67 49.85,67.94 87.63,67.94 88.9,69.22 91.44,69.22 92.71,67.94 v94.93,67.94 101.28,67.94 102.55,66.67 v123.19,66.67 | CON1.19 42.86,24.45 v44.77,26.35 | U$1.5 v44.77,66.67 | v94.93,46.35 92.71,46.35 91.44,47.62 IC11.11
A2  (via drill 0.6 pad 1.42)
  Top 0.406: v74.93,65.41 v74.93,25.4 | v86.36,14.29 v86.36,45.09 | v46.67,34.92 v46.67,26.35
  Bottom 0.406: U$1.6 48.58,64.14 49.85,65.41 v74.93,65.41 | SV1.15 140.34,69.22 142.88,69.22 146.05,66.04 146.05,54.29 147.96,52.39 147.96,18.41 136.53,6.99 93.34,6.99 v86.36,14.29 v74.93,25.4 67.94,32.38 49.21,32.38 v46.67,34.92 | CON1.18 44.13,23.81 v46.67,26.35
  Bottom 0.61: v86.36,45.09 IC11.12
A3  (via drill 0.6 pad 1.42)
  Top 0.406: v72.39,62.87 v72.39,26.04
  Bottom 0.406: U$1.7 48.58,61.59 49.85,62.87 v72.39,62.87 | SV1.16 142.88,70.48 147,66.36 147,54.61 148.91,52.7 148.91,18.1 136.84,6.03 92.39,6.03 v72.39,26.04
A7  (via drill 0.6 pad 1.42)
  Top 0.406: v93.98,34.29 v93.98,8.26
  Bottom 0.406: SV1.20 142.88,65.41 145.1,63.18 145.1,53.98 147,52.07 147,18.73 136.53,8.26 v93.98,8.26
  Bottom 0.61: v93.98,34.29 IC6.1
A8  (via drill 0.6 pad 1.42)
  Top 0.406: v91.44,31.75 v91.44,10.79
  Bottom 0.406: SV1.21 140.34,61.59 142.56,61.59 143.19,60.96 143.19,53.34 145.1,51.44 145.1,19.37 136.53,10.79 v91.44,10.79
  Bottom 0.61: v91.44,31.75 IC6.2
A9  (via drill 0.6 pad 1.42)
  Top 0.406: v92.71,29.21 v92.71,9.53
  Bottom 0.406: SV1.22 142.56,62.87 144.15,61.28 144.15,53.66 146.05,51.75 146.05,19.05 136.53,9.53 v92.71,9.53
  Bottom 0.61: v92.71,29.21 IC6.3
ATN  (via drill 0.6 pad 1.42)
  Top 0.406: v27.3,78.11 v27.3,91.12
  Bottom 0.406: IC1.6 32.38,79.38 31.11,78.11 v27.3,78.11 | v27.3,91.12 28.89,91.12 30.8,93.03 30.8,94.93 32.82,96.95 R14.1
  Bottom 0.61: R14.1 R20.2
ATN_OUT
  Bottom 0.61: IC4.40 IC1.5
CF_CS0  (via drill 0.6 pad 1.42)
  Top 0.406: v58.1,26.04 v70.48,26.04 | v108.27,19.05 v108.27,4.76
  Bottom 0.406: CON1.7 v58.1,26.04 | v108.27,4.76 91.76,4.76 v70.48,26.04
  Bottom 0.61: IC6.10 v108.27,19.05
CLK  (via drill 0.6 pad 1.42)
  Top 0.406: v20.4,38.73 v20.4,84.45
  Bottom 0.406: IC1.4 v20.4,84.45 R13.1 | IC4.23 v20.4,38.73
  Bottom 0.61: R13.1 R22.1
CLK_OUT
  Bottom 0.406: IC4.39 31.11,79.38 32.38,80.64 35.56,80.64 36.2,81.28 36.2,86.36 35.56,87 IC1.3
CS_0  (via drill 0.6 pad 1.42)
  Top 0.406: v95.25,26.67 v95.25,14.61
  Bottom 0.406: SV1.37 140.34,41.27 140.34,38.73 142.24,36.83 142.24,20.32 136.53,14.61 v95.25,14.61
  Bottom 0.61: v95.25,26.67 IC6.4
CTS_RS232
  Bottom 0.406: IC2.8 115.25,79.38 110.49,84.14 110.49,99.06 109.12,100.43 X1.8
CTS_TTL  (via drill 0.6 pad 1.42)
  Top 0.406: v117.47,59.05 v117.47,73.34
  Bottom 0.406: U1.9 125.09,60.33 123.83,59.05 v117.47,59.05 | IC2.9 122.24,79.38 117.47,74.61 v117.47,73.34
D0  (via drill 0.6 pad 1.42)
  Top 0.406: v40.32,28.57 v40.32,65.41
  Bottom 0.406: SV1.5 137.79,83.19 130.49,75.88 130.49,68.26 128.91,66.67 125.09,66.67 123.83,65.41 U1.18 IC11.25 92.71,65.41 91.44,66.67 88.9,66.67 87.63,65.41 81.28,65.41 80.01,66.67 IC3.12 U$1.14 49.85,66.67 48.58,65.41 v40.32,65.41 32.38,65.41 31.11,66.67 IC4.34 | CON1.21 v40.32,28.57
D1  (via drill 0.6 pad 1.42)
  Top 0.406: v36.2,26.67 v36.2,62.87
  Bottom 0.406: SV1.6 140.34,81.92 137.79,81.92 131.44,75.56 131.44,66.67 128.91,64.14 125.09,64.14 123.83,62.87 U1.19 IC11.24 92.71,62.87 91.44,64.14 88.9,64.14 87.63,62.87 81.28,62.87 80.01,64.14 IC3.13 U$1.13 49.85,64.14 48.58,62.87 v36.2,62.87 32.38,62.87 31.11,64.14 IC4.33 | v36.2,26.67 39.05,23.81 CON1.22
D2  (via drill 0.6 pad 1.42)
  Top 0.406: v34.92,25.4 v34.92,61.59
  Bottom 0.406: SV1.7 137.79,80.64 132.4,75.25 132.4,65.09 128.91,61.59 125.09,61.59 123.83,60.33 U1.20 IC11.23 92.71,60.33 91.44,61.59 88.9,61.59 87.63,60.33 73.03,60.33 71.75,61.59 IC3.14 U$1.12 49.85,61.59 48.58,60.33 46.04,60.33 44.77,61.59 v34.92,61.59 IC4.32 | v34.92,25.4 36.2,25.4 37.78,23.81 CON1.23
D3  (via drill 0.6 pad 1.42)
  Top 0.406: v64.45,29.21 v64.45,59.05
  Bottom 0.406: SV1.8 140.34,79.38 137.79,79.38 133.35,74.93 133.35,63.5 128.91,59.05 125.09,59.05 123.83,57.78 U1.21 IC11.22 92.71,57.78 91.44,59.05 88.9,59.05 87.63,57.78 78.11,57.78 76.83,59.05 IC3.15 v64.45,59.05 U$1.11 49.85,59.05 48.58,57.78 46.04,57.78 44.77,59.05 IC4.31 | CON1.2 v64.45,29.21
D4  (via drill 0.6 pad 1.42)
  Top 0.406: v63.18,30.48 v63.18,55.24
  Bottom 0.406: SV1.9 137.79,78.11 134.3,74.61 134.3,61.91 128.91,56.52 125.09,56.52 123.83,55.24 U1.22 IC11.21 92.71,55.24 91.44,56.52 87,56.52 85.72,55.24 77.79,55.24 76.52,56.52 IC3.16 64.45,56.52 v63.18,55.24 32.38,55.24 31.11,56.52 IC4.30 | CON1.3 v63.18,30.48
D5  (via drill 0.6 pad 1.42)
  Top 0.406: v61.91,29.21 v61.91,53.98
  Bottom 0.406: SV1.10 140.34,76.83 137.79,76.83 135.25,74.3 135.25,60.33 128.91,53.98 125.09,53.98 123.83,52.7 U1.23 IC11.20 92.71,52.7 91.44,53.98 88.9,53.98 87.63,52.7 78.11,52.7 76.83,53.98 IC3.17 v61.91,53.98 IC4.29 | CON1.4 v61.91,29.21
D6  (via drill 0.6 pad 1.42)
  Top 0.406: v60.64,30.48 v60.64,51.44
  Bottom 0.406: SV1.11 137.79,75.56 136.21,73.98 136.21,56.2 131.44,51.44 125.09,51.44 123.83,50.16 U1.24 IC11.19 92.71,50.16 91.44,51.44 88.9,51.44 87.63,50.16 81.28,50.16 80.01,51.44 IC3.18 v60.64,51.44 IC4.28 | CON1.5 v60.64,30.48
D7  (via drill 0.6 pad 1.42)
  Top 0.406: v59.37,29.21 v59.37,48.9
  Bottom 0.406: SV1.12 140.34,74.3 137.79,74.3 137.16,73.66 137.16,55.56 130.49,48.9 125.09,48.9 123.83,47.62 U1.25 IC11.18 92.71,47.62 91.44,48.9 85.09,48.9 83.82,47.62 81.28,47.62 80.01,48.9 IC3.19 v59.37,48.9 IC4.27 | CON1.6 v59.37,29.21
DATA  (via drill 0.6 pad 1.42)
  Top 0.406: v25.72,41.27 v25.72,89.53
  Bottom 0.406: IC4.24 v25.72,41.27 | 32.07,89.53 v25.72,89.53 25.72,91.76 26.67,92.71 28.57,92.71 29.53,93.66 29.53,95.57 30.4,96.44 R21.2 | 32.07,89.53 IC1.2 | 32.07,89.53 32.07,93.98 32.7,94.61 R12.1
DATA_OUT
  Bottom 0.406: IC4.38 31.11,76.83 32.38,78.11 35.56,78.11 37.15,79.69 37.15,90.81 35.88,92.08 IC1.1
FI2
  Bottom 0.406: SV1.35 133.35,45.09 129.54,41.27 116.52,41.27 115.25,42.55 U1.27 109.22,42.55 106.68,45.09 IC11.17
GATE1  (via drill 0.6 pad 1.42)
  Top 0.406: v98.42,73.66 v98.42,69.22 | v86.36,53.98 v86.36,74.3
  Bottom 0.406: v86.36,74.3 87.63,74.3 88.58,75.25 96.84,75.25 v98.42,73.66 | IC11.26 102.87,67.94 101.6,69.22 v98.42,69.22 | IC3.24 v86.36,53.98
GATE2  (via drill 0.6 pad 1.42)
  Top 0.406: v85.09,51.44 v85.09,69.22
  Bottom 0.406: IC11.2 88.9,70.48 87.63,69.22 v85.09,69.22 | IC3.23 v85.09,51.44
GATE_SND
  Bottom 0.406: IC11.5 88.9,62.87 87.63,61.59 IC3.27
GND  (via drill 0.6 pad 1.42)
  Top 0.61: v41.91,73.98 v41.91,57.15 | v54.61,40.64 v54.61,45.72 | v134.3,3.81 v134.3,16.51 | v101.6,16.51 v101.6,2.54 | v95.57,77.15 v95.57,72.39 | v123.51,39.69 v123.51,36.51 | v15.24,92.39 v22.23,92.39 | v100.01,99.69 v104.46,99.69 | v38.1,105.09 v38.1,110.17
  Top 0.813: v87.95,110.17 v87.95,105.09 | v66.04,110.17 v66.04,105.09
  Bottom 0.406: CON1.50 34.61,17.14 45.4,17.14 | 45.4,17.14 46.67,17.14 | 46.67,17.14 47.94,17.14 | 47.94,17.14 48.58,17.14 | 48.58,17.14 49.21,17.14 | 49.21,17.14 51.75,17.14 | 51.75,17.14 53.02,17.14 | 53.02,17.14 54.29,17.14 | 54.29,17.14 55.56,17.14 | 55.56,17.14 56.83,17.14 | 56.83,17.14 57.78,17.14 | 57.78,17.14 65.72,17.14 CON1.1 | CON1.17 45.4,17.14 | CON1.16 46.67,17.14 | CON1.15 47.94,17.14 | CON1.14 49.21,17.14 | CON1.12 51.75,17.14 | CON1.11 53.02,17.14 | CON1.10 54.29,17.14 | CON1.8 56.83,17.14 | CON1.39 48.58,17.14 | CON1.9 55.56,17.14 | 57.47,17.46 57.78,17.14
  pour Bottom (isolate 0.61, no thermals): 0,117.47 0,0 151.13,0 151.13,117.47
IRQ  (via drill 0.6 pad 1.42)
  Top 0.406: v49.85,76.83 v49.85,33.66 | v114.3,45.09 v114.3,12.06 | v116.2,51.44 v116.2,45.09
  Bottom 0.406: v49.85,33.66 68.9,33.66 90.49,12.06 v114.3,12.06 136.53,12.06 144.15,19.68 144.15,51.12 142.56,52.7 SV1.30 | IC11.9 91.44,52.7 92.71,51.44 v116.2,51.44
  Bottom 0.61: U$1.1 v49.85,76.83 | U1.26 v114.3,45.09 v116.2,45.09
KBD_CS  (via drill 0.6 pad 1.42)
  Top 0.406: v77.47,81.92 v77.47,33.02
  Bottom 0.406: IC3.6 v77.47,81.92 | IC6.13 103.82,26.67 102.87,27.62 102.87,29.21 99.06,33.02 v77.47,33.02
KCLK
  Bottom 0.406: J1.1 73.03,104.97 | 73.03,104.97 74.09,104.97 74.93,104.14 74.93,94.61 | IC3.1 74.93,94.61 | R7.1 73.03,104.97 | 74.93,94.61 74.93,92.39 76.2,91.12 79.38,91.12 80.33,90.17 80.33,86.68 81.28,85.72 85.09,85.72 87.02,83.8 C8.1 | IC5.6
  Bottom 0.61: C8.1 IC5.6
KDAT
  Bottom 0.406: IC5.2 C7.1 | C7.1 | C7.1 IC3.39 76.52,92.08 75.88,92.71 75.88,100.01 77.47,101.6 J1.2
  Bottom 0.813: R8.1 J1.2
N$2
  Bottom 0.61: IC2.6 C24.1
N$3
  Bottom 0.61: IC3.38 IC5.3
N$5
  Bottom 0.813: R1.1 QG1.1
N$9
  Bottom 0.61: C4.2 IC2.1
N$10
  Bottom 0.61: IC2.4 118.86,89.53 C5.2
N$11
  Bottom 0.61: IC2.5 C5.1
N$12
  Bottom 0.406: C4.1 113.67,93.34 114.94,92.08 IC2.3
N$13
  Bottom 0.406: IC2.2 118.43,94.61 119.06,93.98 119.06,91.44 118.43,90.81 C6.1
N$15
  Bottom 0.61: IC3.2 64.01,92.08 Q2.2 C9.2
N$16
  Bottom 0.61: IC3.3 64.01,89.53 Q2.1 C11.2
N$17
  Bottom 0.61: IC3.37 85.72,87 88.27,84.45 IC5.5
N$18
  Bottom 0.406: IC6.6 102.55,21.59 103.82,20.32 107,20.32 107.95,21.27 107.95,26.67 111,29.72 R9.1
N$19
  Bottom 0.406: CON1.44 42.23,26.87 R4.1
N$20
  Bottom 0.406: CON1.36 52.39,26.85 R3.1
N$21
  Bottom 0.406: CON1.46 39.69,26.99 38.62,28.05 R5.1
N$22
  Bottom 1.016: BATTERY_1.+ D1.A
N$23  (via drill 0.6 pad 1.27)
  other vias: 5,112.31
N$24  (via drill 0.6 pad 1.27)
  other vias: 145.97,5
N$25  (via drill 0.6 pad 1.27)
  other vias: 145.97,112.31
N$26
  Bottom 0.813: PAD1.1 102.23,78.3 101.23,77.29 Q3.3
N$27
  Bottom 0.61: U1.2 R10.2
N$29
  Bottom 0.406: CON1.32 57.47,24.07 R2.1
N$30
  Bottom 0.406: IC11.6 91.44,60.33 92.71,59.05 R6.2
N$31
  Bottom 0.406: IC11.16 101.92,42.55 101.28,43.18 R15.1
N$32
  Bottom 0.406: IC11.28
  Bottom 0.61: R16.2 IC11.28
N$33
  Bottom 0.406: IC11.4 91.44,65.41 92.71,64.14 R17.2
N$34
  Bottom 0.406: IC11.7 91.44,57.78 92.71,56.52 R18.2
N$35
  Bottom 0.61: IC3.5 70.17,84.45 R19.1
N$36
  Bottom 0.61: R20.1 34.29,103.39 J2.3
N$37  (via drill 0.6 pad 1.27)
  other vias: 5,5
N$38
  Bottom 0.61: R21.1 J2.5
N$39
  Bottom 0.61: R22.2 J2.4
N$40
  Bottom 0.406: IC5.4 91.44,87 92.39,87.95 92.39,93.66 91.44,94.61 IC5.1
  Bottom 0.61: R23.1 IC5.1
PA0
  Bottom 0.406: JP4.8 IC4.4
PA1
  Bottom 0.406: JP4.6 IC4.3
PA2
  Bottom 0.406: JP4.4 IC4.2
PA3
  Bottom 0.406: JP4.2 IC4.1
PA7
  Bottom 0.406: IC4.37 17.14,74.3 15.88,75.56 8.26,75.56 JP4.7
PB0
  Bottom 0.406: JP4.36 IC4.18
PB1
  Bottom 0.406: JP4.38 IC4.19
PB2
  Bottom 0.406: JP4.40 IC4.20
PB3
  Bottom 0.406: IC4.21 17.14,33.66 15.88,34.92 8.26,34.92 JP4.39
PB4
  Bottom 0.406: IC4.22 17.14,36.2 15.88,37.47 8.26,37.47 JP4.37
PC0
  Bottom 0.406: IC4.14 JP4.28
PC1
  Bottom 0.406: IC4.15 JP4.30
PC2
  Bottom 0.406: IC4.16 JP4.32
PC3
  Bottom 0.406: IC4.17 JP4.34
PC4
  Bottom 0.406: JP4.26 IC4.13
PC5
  Bottom 0.406: JP4.24 IC4.12
PC6
  Bottom 0.406: JP4.22 IC4.11
PC7
  Bottom 0.406: JP4.20 IC4.10
RD  (via drill 0.6 pad 1.42)
  Top 0.406: v117.47,53.98 v117.47,43.81 | v71.12,60.33 v71.12,76.83 | v26.99,60.33 v26.99,71.75 | v57.78,30.48 v57.78,60.33 | v93.34,53.98 v93.34,76.52
  Bottom 0.305: CON1.34 54.93,25.08 57.78,27.94 v57.78,30.48
  Bottom 0.406: SV1.33 133.99,47.62 130.18,43.81 v117.47,43.81 | IC3.8 v71.12,76.83 80.01,76.83 81.28,75.56 87.63,75.56 88.58,76.52 v93.34,76.52 | IC4.5 v26.99,71.75 | v26.99,60.33 44.77,60.33 46.04,59.05 U$1.8 48.58,59.05 49.85,60.33 v57.78,60.33 v71.12,60.33 | v117.47,53.98 v93.34,53.98
RST  (via drill 0.6 pad 1.42, 1.4 pad 2.29)
  Top 0.406: v48.58,26.35 v48.58,34.92 | v69.85,87 v69.85,34.92 | v87.63,17.14 v87.63,55.24 | v37.78,74.3 v37.78,36.83 | v24.13,81.92 v24.13,87.63
  Bottom 0.406: v87.63,55.24 IC11.8 | CON1.41 46.04,23.81 v48.58,26.35 | IC1.9 40.64,79.38 40.01,78.74 40.01,77.79 39.05,76.83 39.05,74.93 38.42,74.3 v37.78,74.3 32.38,74.3 31.11,75.56 26.67,75.56 24.13,78.11 v24.13,81.92 | v37.78,36.83 46.67,36.83 v48.58,34.92 v69.85,34.92 v87.63,17.14 91.44,13.34 136.53,13.34 143.19,20 143.19,50.8 142.56,51.44 140.34,51.44 SV1.29 135.89,52.7 130.81,47.62 U1.4 | v24.13,87.63 24.13,92.08 25.4,93.34 v25.4,99.97
  Bottom 0.61: IC3.4 v69.85,87
RST_INV  (via drill 0.6 pad 1.42)
  Top 0.406: v33.02,69.22 v33.02,73.03
  Bottom 0.406: IC4.35 v33.02,69.22 | IC1.8 40.64,76.83 40.01,76.2 40.01,74.3 38.73,73.03 v33.02,73.03
  Bottom 0.61: IC4.35 R11.1
RTC_CS  (via drill 0.6 pad 1.42)
  Top 0.406: v51.12,74.3 v51.12,38.1
  Bottom 0.406: IC6.12 104.14,24.13 101.6,26.67 101.6,28.89 100.01,30.48 77.79,30.48 71.12,37.15 52.07,37.15 v51.12,38.1
  Bottom 0.61: v51.12,74.3 U$1.2
RTS_RS232
  Bottom 0.406: IC2.7 115.25,81.92 111.86,85.31 X1.7
RTS_TTL  (via drill 0.6 pad 1.42)
  Top 0.406: v120.65,56.52 v120.65,80.64
  Bottom 0.406: U1.8 125.09,57.78 123.83,56.52 v120.65,56.52
  Bottom 0.61: IC2.10 121.92,81.92 v120.65,80.64
RW
  Bottom 0.406: SV1.36 140.34,43.81 133.99,43.81 128.27,38.1 115.57,38.1 113.67,40.01 U1.28 110.49,40.01 109.22,41.27 101.6,41.27 100.33,42.55 IC11.13
RXD_RS232
  Bottom 0.406: IC2.13 122.24,89.53 120.97,90.81 120.97,97.79 119.06,99.69 114.3,99.69 113.23,100.76 X1.2
RXD_TTL  (via drill 0.6 pad 1.42)
  Top 0.406: v121.92,67.94 v121.92,75.88
  Bottom 0.406: v121.92,67.94 U1.12 | v121.92,75.88 124.78,75.88 127.64,78.74 127.64,85.72 126.36,87 IC2.12
SND_PULSE  (via drill 0.6 pad 1.42)
  Top 0.406: v102.23,59.05 v102.23,71.75
  Bottom 0.406: R6.1 v102.23,59.05
  Bottom 0.61: v102.23,71.75 102.23,74.87 Q3.1
SOSCI
  Bottom 0.61: U$1.17 57.78,74.3 | 57.78,74.3 C20.2 | X2.1 57.78,74.3
SOSCO
  Bottom 0.61: U$1.16 57.78,71.75 | 57.78,71.75 C23.2 | X2.2 57.78,71.75
SRQ_IN  (via drill 0.6 pad 1.42)
  Top 0.406: v19.05,76.2 v19.05,43.81
  Bottom 0.406: v19.05,43.81 IC4.25 | J2.1 18.1,95.57 19.05,94.62 v19.05,76.2
TIMER_CS  (via drill 0.6 pad 1.42)
  Top 0.406: v101.92,33.02 v101.92,40.01
  Bottom 0.406: v101.92,33.02 101.92,31.75 104.46,29.21 IC6.14
  Bottom 0.61: v101.92,40.01 IC11.15
TXD_RS232  (via drill 0.6 pad 1.42)
  Top 0.406: v110.49,101.28 v114.62,101.28
  Bottom 0.406: IC2.14 122.56,92.08 121.92,92.71 121.92,98.11 118.75,101.28 v114.62,101.28 | X1.3 v110.49,101.28
TXD_TTL  (via drill 0.6 pad 1.42)
  Top 0.406: v119.38,61.59 v119.38,73.34
  Bottom 0.406: U1.10 125.09,62.87 123.83,61.59 v119.38,61.59 | IC2.11 126.05,84.45 126.68,83.82 126.68,79.06 124.78,77.15 121.28,77.15 119.38,75.25 v119.38,73.34
UART_CLK  (via drill 0.6 pad 1.42)
  Top 0.406: v134.3,56.83 v134.3,39.05
  Bottom 0.406: U1.6 130.18,52.7 v134.3,56.83
  Bottom 0.61: v134.3,39.05 QG1.8
UART_CS  (via drill 0.6 pad 1.42)
  Top 0.406: v108.58,46.35 v108.58,31.75
  Bottom 0.406: U1.3 118.11,45.09 116.84,46.35 v108.58,46.35
  Bottom 0.61: v108.58,31.75 IC6.15
VCC  (via drill 0.6 pad 1.42)
  Top 0.406: v43.5,67.94 v43.5,71.75 | v56.52,29.21 v56.52,43.5 | v80.33,59.05 v80.33,56.52
  Top 0.61: v43.5,31.43 v43.5,43.5 | v17.57,69.22 v17.57,85.09 | v22.23,69.22 v22.23,46.35 | v98.42,44.45 v98.42,40.01 | v98.42,46.35 v98.42,56.52 | v96.84,64.14 v96.84,56.52 | v78.74,89.53 v78.74,94.61 | v78.74,85.72 v78.74,59.05 | v113.67,87.03 v106.64,87.03
  Bottom 0.406: CON1.13 50.48,28.57 | CON1.38 49.85,28.57 | R8.2 82.27,104.98 82.47,104.78 | R7.2 73.03,107.63 | U$1.15 49.85,69.22 48.58,67.94 v43.5,67.94 | C12.2 50.16,28.57 | v56.52,29.21 56.52,27.87 R2.2 | R10.1 116.52,42.55 115.25,43.81 109.22,43.81 106.68,46.35 100.97,46.35 100.96,46.35 R15.2 | C22.2 47.94,28.89 48.26,28.57
  Bottom 0.61: C14.1 | v43.5,71.75 U$1.3 51.44,71.75 52.7,73.03 52.7,76.83 50.16,79.38 50.16,83.82 51.44,85.09 53.98,85.09 54.93,86.04 D2.A | C15.1 82.47,97.16 | C16.1 33.02,46.35 | C3.1 92.71,40.01 | R9.2 111.09,34.25 111.12,34.29 | 100.97,46.35 v98.42,46.35 v98.42,44.45 | C2.1 111.44,76.2 | v22.23,69.22 R11.2 | R18.1 v96.84,56.52 v98.42,56.52 | R17.1 v96.84,64.14 | C21.+ | v78.74,59.05 v80.33,59.05 IC3.26 | IC3.25 v80.33,56.52 | R19.2 v78.74,85.72 v78.74,89.53 | R23.2 90.17,107.63 | C6.2 v113.67,87.03
  Bottom 0.813: R1.2 QG1.14 C1.1 | v78.74,94.61 IC3.40 | R3.2 50.48,28.57 50.16,28.57 49.85,28.57 48.26,28.57 46.35,28.57 45.09,29.84 45.08,29.84 R4.2 v43.5,31.43 R5.2 | C19.1 IC1.14 R12.2 R14.2 54.93,96.95 | v17.57,69.22 v22.23,69.22 | C2.1 111.44,77.83 R16.1 | R16.1 | PAD2.1 v106.64,87.03 106.64,82.62 R16.1
  Bottom 1.016: IC2.16 C14.1 | 82.55,107.63 82.47,107.55 82.47,104.78 J1.5 82.47,97.16 82.47,94.69 IC3.40 | 102.23,94.61 IC5.14 C17.1 | U1.15 111.44,76.2 | QG1.14 116.84,30.8 113.35,34.29 111.12,34.29 IC6.16 104.14,34.29 v98.42,40.01 92.71,40.01 IC11.14 | 102.23,94.61 102.23,111.12 | v17.57,85.09 17.57,93.72 R13.2 | 102.23,94.61 PAD2.1
  Bottom 1.27: JP3.2 139.06,99.69 136.53,97.16 C10.+ 129.35,97.16 | 129.35,97.16 129.35,106.23 124.46,111.12 102.23,111.12 96.52,111.12 93.03,107.63 90.17,107.63 82.55,107.63 73.03,107.63 54.93,107.63 | C14.1 129.35,97.16 | v22.23,46.35 IC4.26 33.02,46.35 40.64,46.35 v43.5,43.5 C21.+ v56.51,43.5 v56.52,43.5 84.77,43.5 88.27,40.01 IC11.14 | 54.93,107.63 54.93,96.95 D2.A | 54.93,107.63 16.83,107.63 15.32,106.12 R13.2
VPA
  Bottom 0.61: U$1.18 C13.2
  Bottom 1.016: D1.C D2.C | U$1.18 D2.C | D2.C C18.+
WR  (via drill 0.6 pad 1.42)
  Top 0.406: v118.75,56.52 v118.75,46.35 | v73.66,57.78 v73.66,71.75 | v59.37,69.22 v59.37,56.52 | v52.39,56.52 v52.39,31.11 | v100.97,56.52 v100.97,70.48
  Bottom 0.406: SV1.34 140.34,48.9 133.67,48.9 131.13,46.35 v118.75,46.35 | v73.66,57.78 63.5,57.78 62.23,56.52 v59.37,56.52 | IC3.10 v73.66,71.75 80.01,71.75 81.28,70.48 87.63,70.48 88.9,71.75 91.44,71.75 92.71,70.48 v100.97,70.48 | IC4.36 31.11,71.75 32.38,70.48 56.2,70.48 57.47,69.22 v59.37,69.22 | CON1.35 53.66,29.84 v52.39,31.11 | v118.75,56.52 v100.97,56.52
  Bottom 0.61: v59.37,56.52 U$1.10 v52.39,56.52